# Altium schematic sheet Perechen_Elementov_KRAC_last.schdoc
size 209 x 297 mm
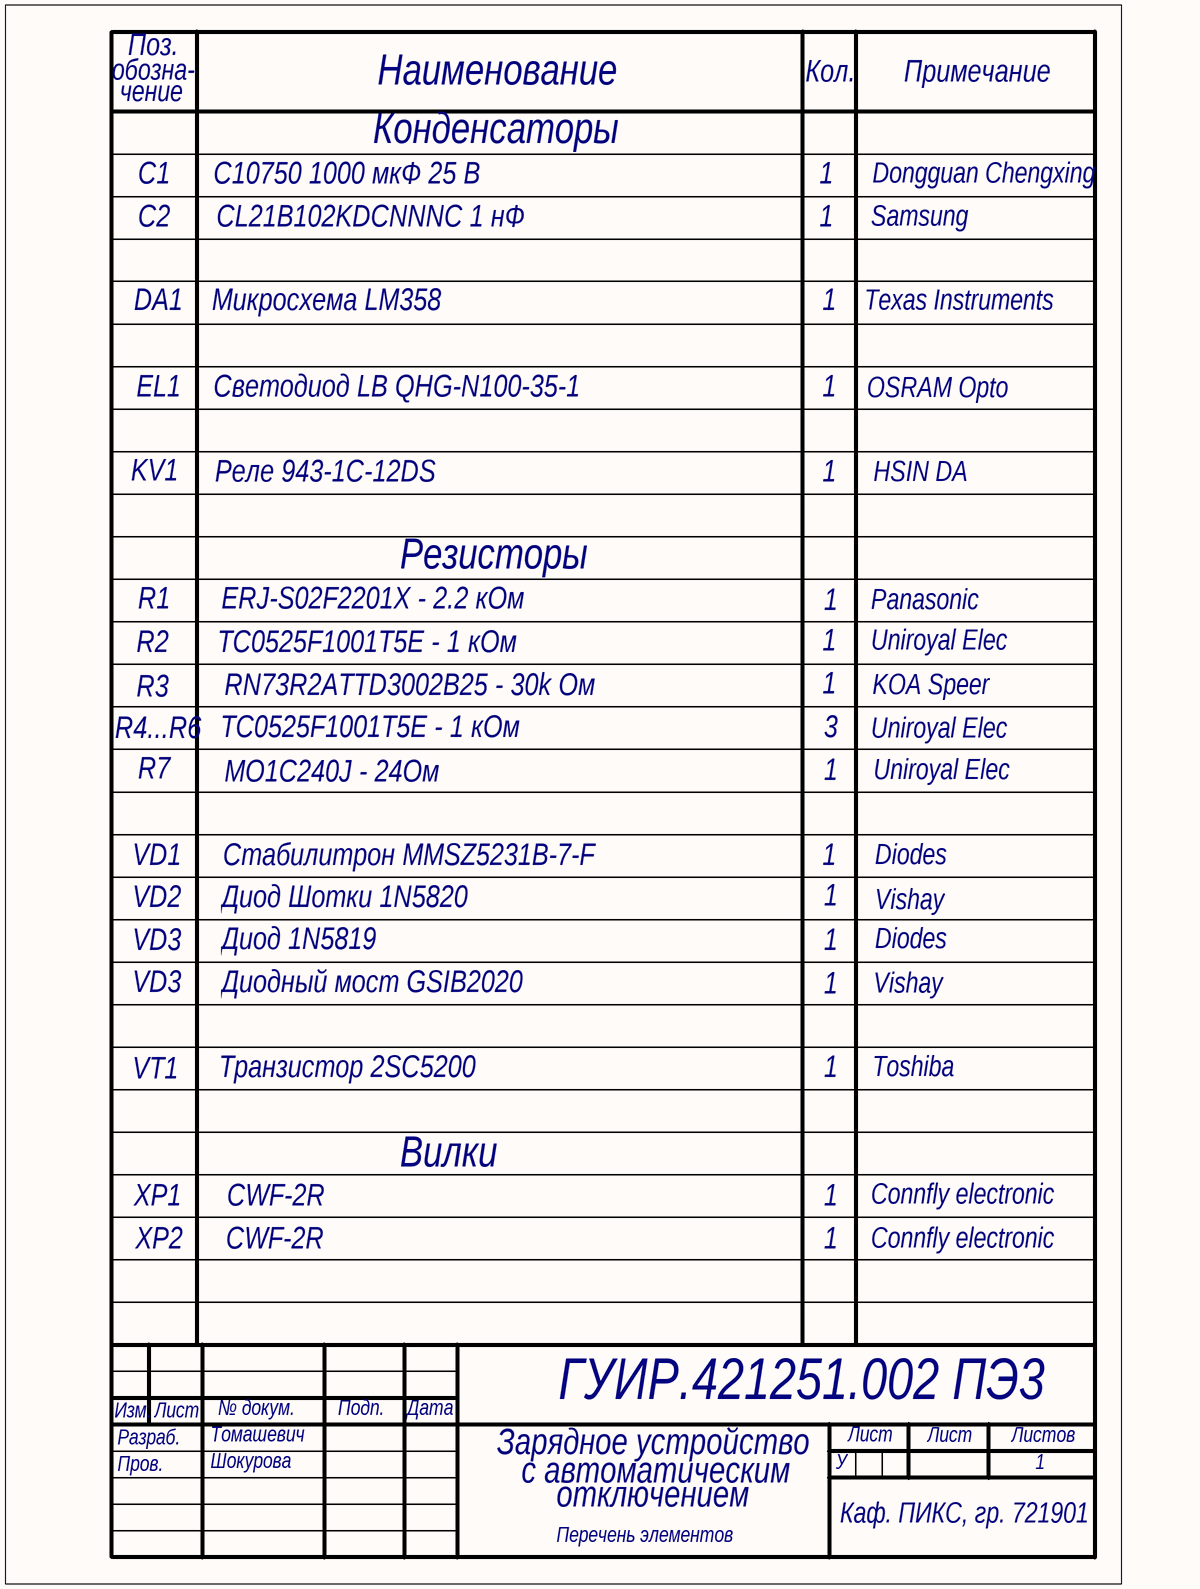
[diagram p0: Perechen_Elementov_KRAC_last.schdoc]

## Notes on the sheet
- Поз.
- обозна-
- чение
- Наименование
- Кол.
- Примечание
- С1
- C10750 1000 мкФ 25 В
- Конденсаторы
- 1
- Dongguan Chengxing
- С2
- CL21B102KDCNNNC 1 нФ
- Samsung
- DA1
- Микросхема LM358
- Texas Instruments
- EL1
- Светодиод LB QHG-N100-35-1
- OSRAM Opto
- KV1
- Реле 943-1C-12DS
- HSIN DA
- Резисторы
- R2
- R1
- TC0525F1001T5E - 1 кОм
- ERJ-S02F2201X - 2.2 кОм
- Uniroyal Elec
- Panasonic
- R3
- RN73R2ATTD3002B25 - 30k Ом
- KOA Speer
- R4...R6
- R7
- MO1C240J - 24Ом
- 3
- VD1
- Стабилитрон MMSZ5231B-7-F
- Diodes
- VD2
- Диод Шотки 1N5820
- Vishay
- VD3
- Диод 1N5819
- Диодный мост GSIB2020
- VT1
- Транзистор 2SC5200
- Toshiba
- Вилки
- Connfly electronic
- XP1
- XP2
- CWF-2R
- ГУИР.421251.002 ПЭ3
- Изм.
- Разраб.
- Пров.
- Лист
- Томашевич
- Шокурова
- № докум.
- Подп.
- Дата
- Зарядное устройство
- У
- Листов
- с автоматическим
- Перечень элементов
- отключением
- Каф. ПИКС, гр. 721901